# EasyEDA Pro project departure_board_controller.epro

# Schematic neo_pixel_carrier

## Sheets
1 Components: Board Name: neo_pixel_carrier; Create Date: 2024-08-07; Page Name: Components; Project Name: neo_pixel_carrier; Schematic Name: neo_pixel_carrier; Update Date: 2024-10-22; Company: EasyEDA.com; Drawn: EasyEDA; Page Size: A4; Part Number: JLCPCB-002; Reviewed: EasyEDA; Version: V0.1
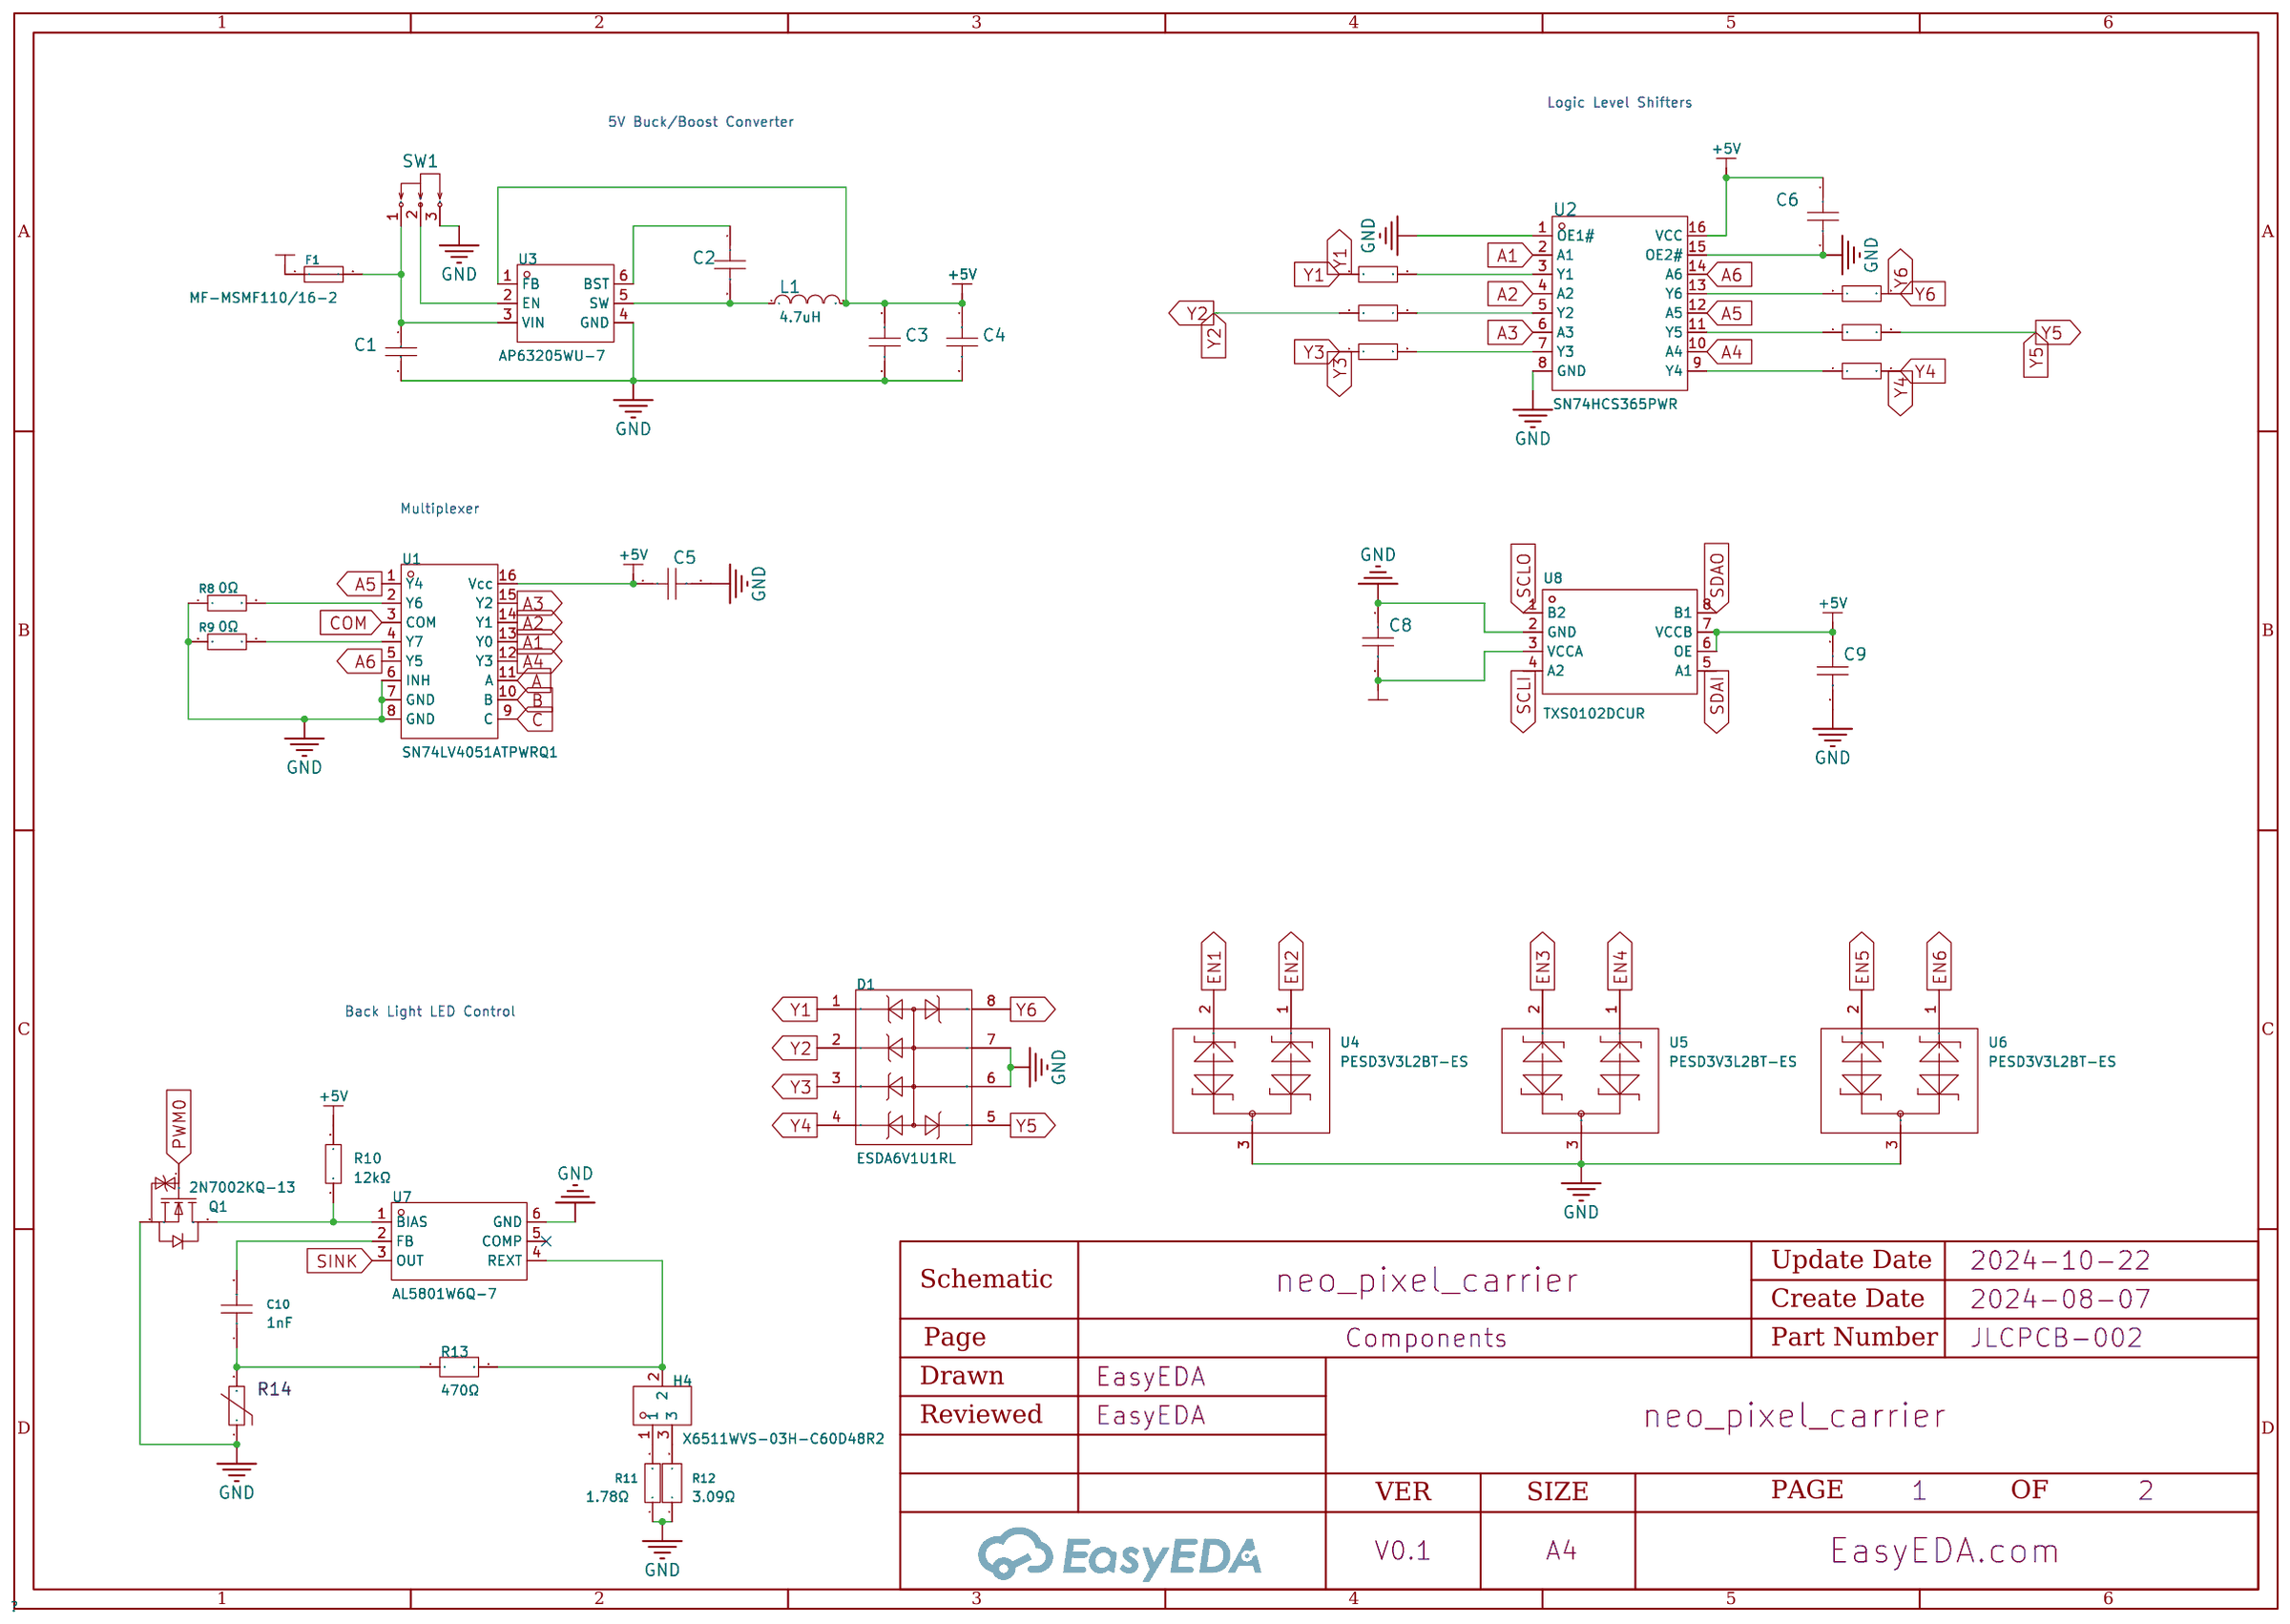
[diagram p0: Components]
2 Connectors: Page Name: Connectors; Update Date: 2024-10-03
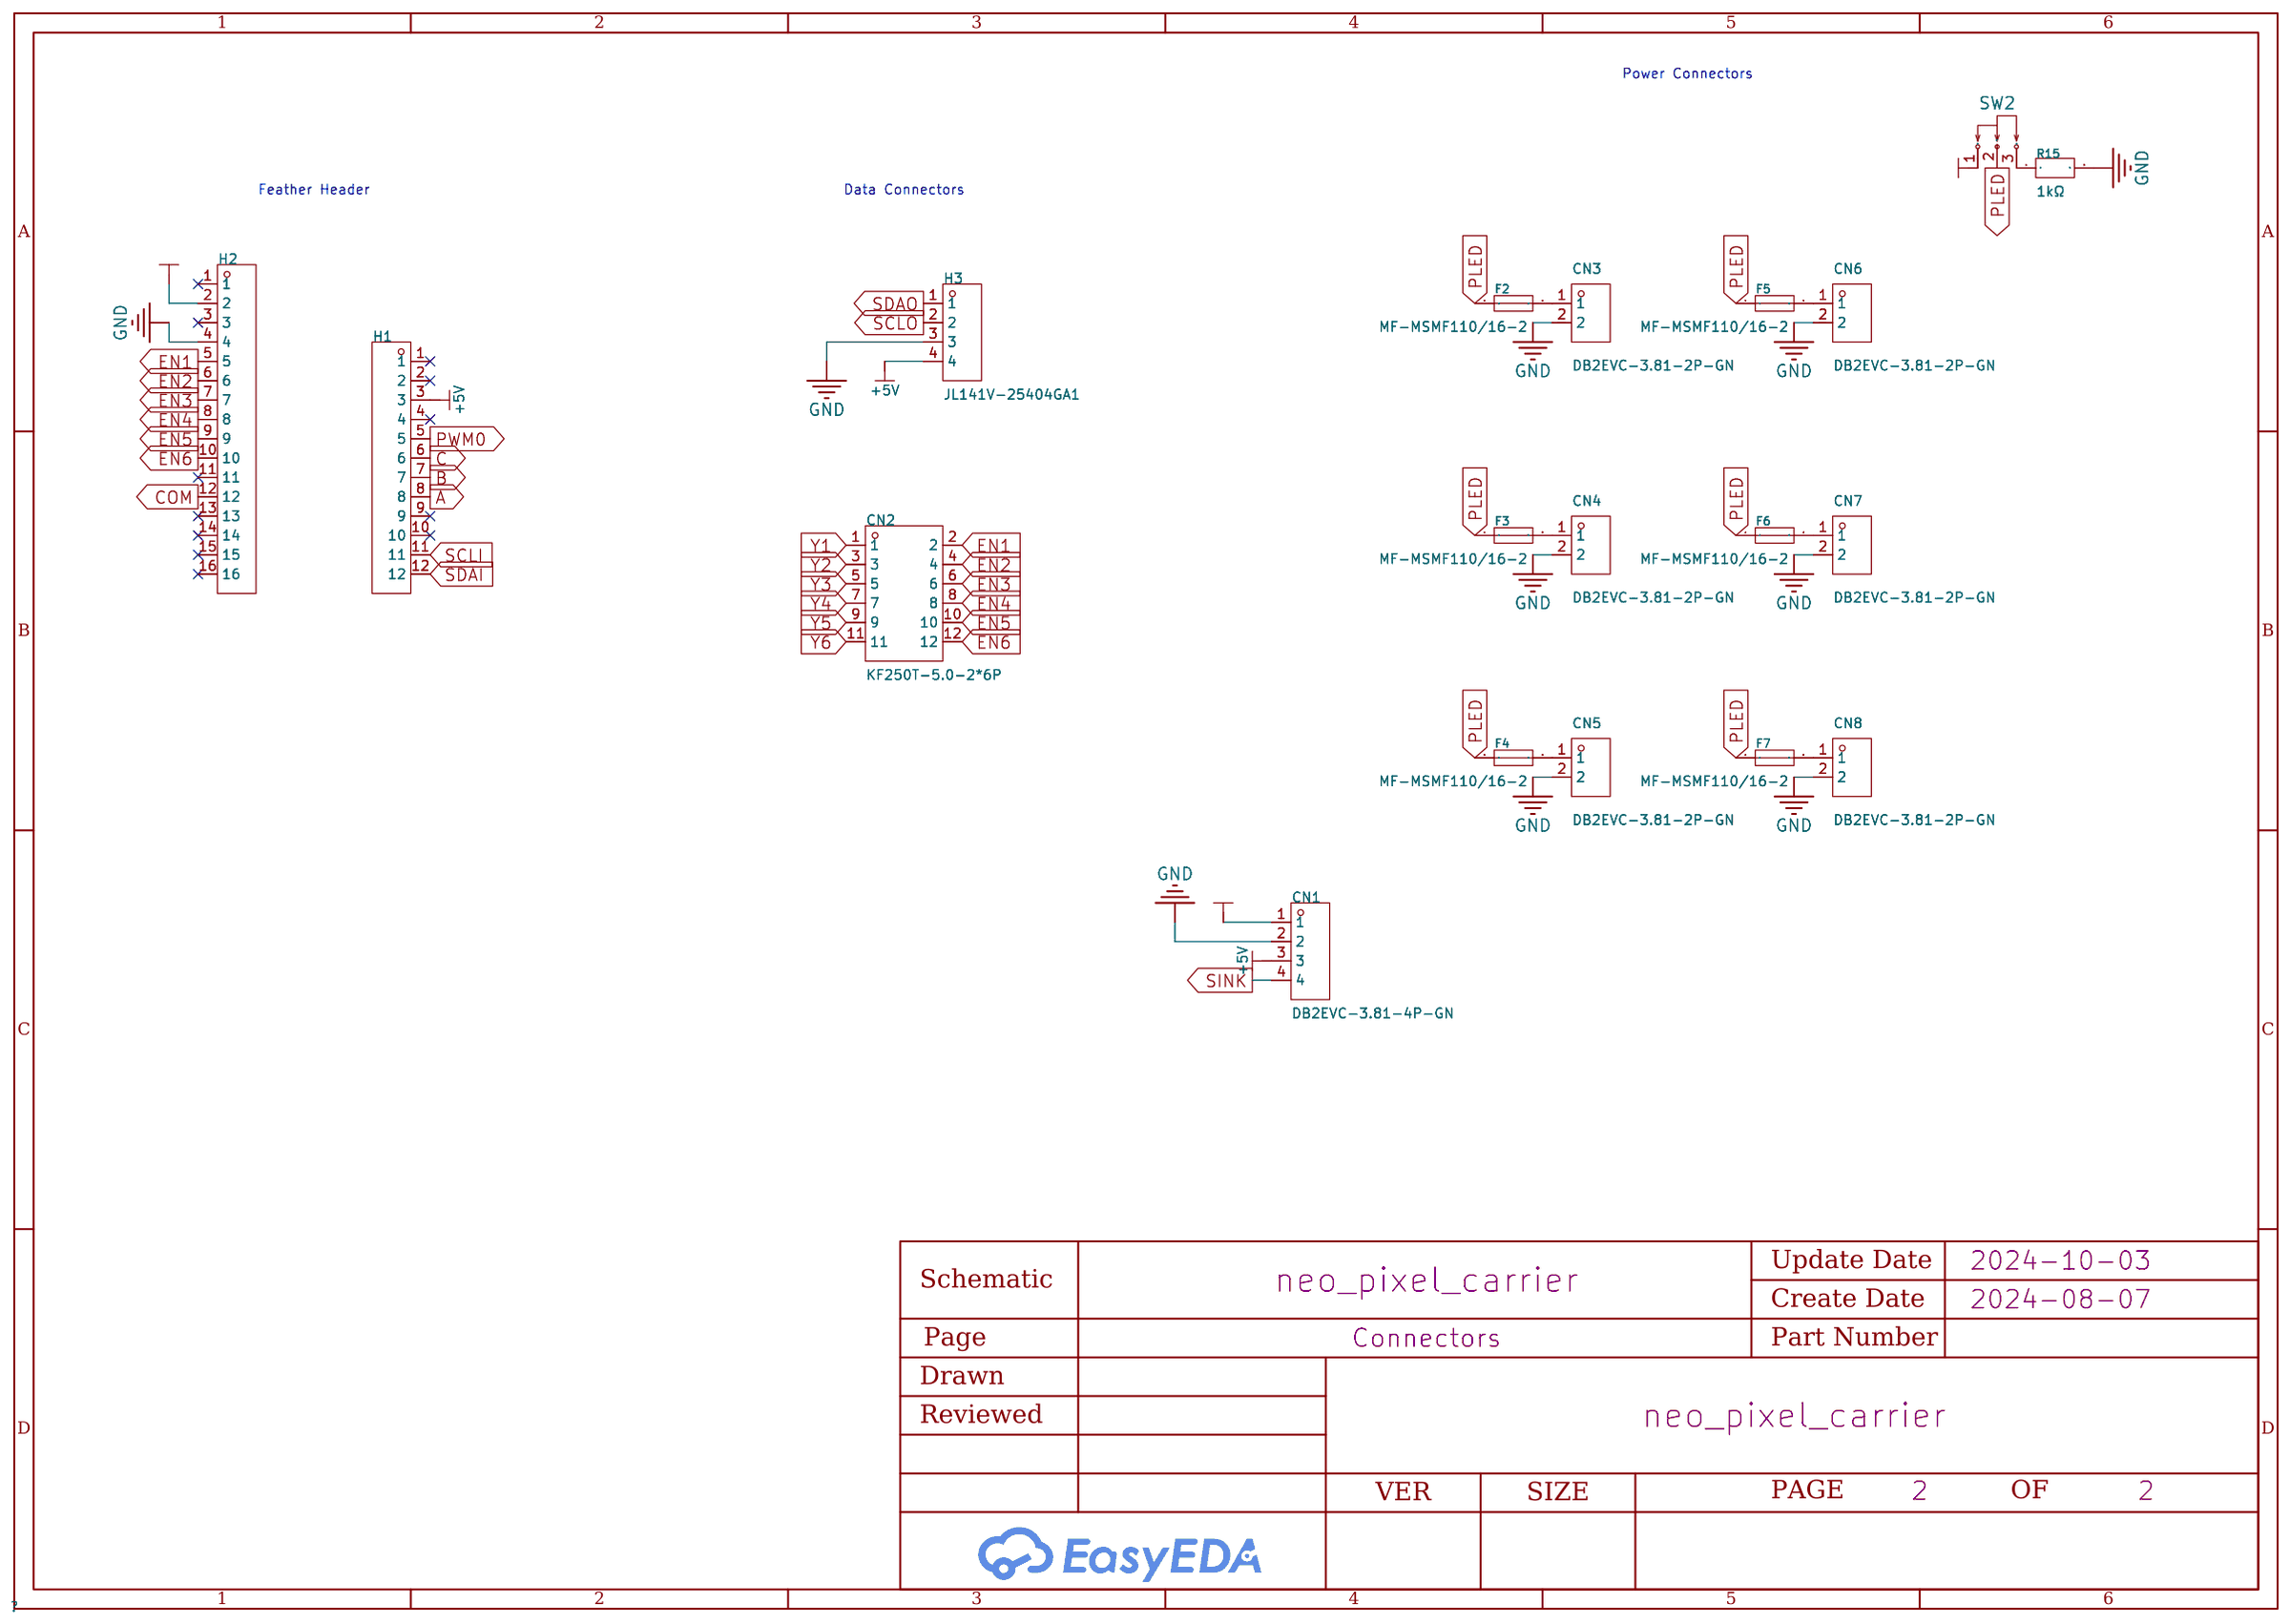
[diagram p1: Connectors]

## Parts
sheet Components
C1  10uF  [C1210]
C2  100nF  [C1206]
C3  22uF  [C1210]
C4  22uF  [C1210]
C5  100nF  [C1206]
C6  100nF  [C1206]
C8  100nF  [C1206]
C9  100nF  [C1206]
C10  1nF  [C0402]
D1  ESDA6V1U1RL  [SO-8_L4.9-W3.9-P1.27-LS5.9-BL]
F1  MF-MSMF110/16-2  [F1812]
H4  X6511WVS-03H-C60D48R2  [HDR-SMD_3P-P2.54_XKB_X6511WVS-03H-C60D48R2]
L1  4.7uH  [IND-SMD_L7.0-W7.0_CDRR7D45T125NP]
Q1  2N7002KQ-13  [SOT-23-3_L2.9-W1.3-P1.90-LS2.4-BR]
R1  100Ω  [R0805]
R2  100Ω  [R0805]
R3  100Ω  [R0805]
R4  100Ω  [R0805]
R5  100Ω  [R0805]
R6  100Ω  [R0805]
R8  0Ω  [R0805]
R9  0Ω  [R0805]
R10  12kΩ  [R0805]
R11  1.78Ω  [R0805]
R12  3.09Ω  [R0805]
R13  470Ω  [R0402]
R14  10k  [R0805]
SW1  SS12D10G4 071  [SW-TH_SHOU-HAN_SS12D10G4]
U1  SN74LV4051ATPWRQ1  [TSSOP-16_L5.0-W4.4-P0.65-LS6.4-BL]
U2  SN74HCS365PWR  [TSSOP-16_L5.0-W4.4-P0.65-LS6.4-BL]
U3  AP63205WU-7  [TSOT-23-6_L2.9-W1.6-P0.95-LS2.8-BL]
U4  PESD3V3L2BT-ES  [SOT-23-3_L2.9-W1.3-P0.95-LS2.4-BR]
U5  PESD3V3L2BT-ES  [SOT-23-3_L2.9-W1.3-P0.95-LS2.4-BR]
U6  PESD3V3L2BT-ES  [SOT-23-3_L2.9-W1.3-P0.95-LS2.4-BR]
U7  AL5801W6Q-7  [SOT-26-6_L3.0-W1.6-P0.95-LS2.8-BL]
U8  TXS0102DCUR  [VSON8_L2.0-W2.3-P0.50-LS3.1-BL]
sheet Connectors
CN1  DB2EVC-3.81-4P-GN  [CONN-TH_4P-P3.81_DB2EVC-3.81-4P]
CN2  KF250T-5.0-2*6P  [CONN-TH_KF250T-5.0-2X6P]
CN3  DB2EVC-3.81-2P-GN  [CONN-TH_2P-P3.81_DB2EVC-3.81-2P-BK]
CN4  DB2EVC-3.81-2P-GN  [CONN-TH_2P-P3.81_DB2EVC-3.81-2P-BK]
CN5  DB2EVC-3.81-2P-GN  [CONN-TH_2P-P3.81_DB2EVC-3.81-2P-BK]
CN6  DB2EVC-3.81-2P-GN  [CONN-TH_2P-P3.81_DB2EVC-3.81-2P-BK]
CN7  DB2EVC-3.81-2P-GN  [CONN-TH_2P-P3.81_DB2EVC-3.81-2P-BK]
CN8  DB2EVC-3.81-2P-GN  [CONN-TH_2P-P3.81_DB2EVC-3.81-2P-BK]
F2  MF-MSMF110/16-2  [F1812]
F3  MF-MSMF110/16-2  [F1812]
F4  MF-MSMF110/16-2  [F1812]
F5  MF-MSMF110/16-2  [F1812]
F6  MF-MSMF110/16-2  [F1812]
F7  MF-MSMF110/16-2  [F1812]
H1  A2541HWV-12P  [HDR-TH_12P-P2.54-V-F]
H2  ZX-PM2.54-1-16PY  [HDR-TH_16P-P2.54-V-F-A]
H3  JL141V-25404GA1  [CONN-TH_4P-P2.54_JILN_JL141V-25404GA1]
R15  1kΩ  [R0805]
SW2  SS12D10G4 071  [SW-TH_SHOU-HAN_SS12D10G4]

## Library data of the parts
C1 = CL32B106KAJNNNE: Capacitance: Tolerance:±10% Tolerance:±10% Voltage Rated: Temperature Coefficient:; LCSC Part Name: 10uF ±10% 25V; Supplier Part: C39232; Manufacturer: SAMSUNG(三星); Supplier Footprint: 1210; JLCPCB Part Class: Extended Part; Datasheet: https://atta.szlcsc.com/upload/public/pdf/source/20160218/1457707763339.pdf; Supplier: LCSC; Tolerance: ±10%; Check: false
C2 C5 C6 C8 C9 = 1206N104J500CT: Capacitance: Tolerance:±5% Tolerance:±5% Voltage Rated: Temperature Coefficient:; LCSC Part Name: 100nF ±5% 50V; Supplier Part: C170182; Manufacturer: Walsin(华新科); Supplier Footprint: 1206; JLCPCB Part Class: Extended Part; Datasheet: https://atta.szlcsc.com/upload/public/pdf/source/20190524/C388053_0CD3F469255EF43E616A57DAC128F58D.pdf; Supplier: LCSC; Tolerance: ±5%; Check: false
C3 C4 = CL32B226KAJNNNE: Capacitance: Tolerance:±10% Tolerance:±10% Voltage Rated: Temperature Coefficient:; LCSC Part Name: 22uF ±10% 25V; Supplier Part: C309062; Manufacturer: SAMSUNG(三星); Supplier Footprint: 1210; JLCPCB Part Class: Extended Part; Datasheet: https://atta.szlcsc.com/upload/public/pdf/source/20160218/1457707763339.pdf; Supplier: LCSC; Tolerance: ±10%; Check: false
C10 = GRM1555C1H102JA01D: Capacitance: Tolerance:±5% Tolerance:±5% Voltage Rated: Temperature Coefficient:; LCSC Part Name: 1nF ±5% 50V; Supplier Part: C76947; Manufacturer: muRata(村田); Supplier Footprint: 0402; JLCPCB Part Class: Extended Part; Datasheet: https://atta.szlcsc.com/upload/public/pdf/source/20180307/C76947_15204091165631407735.pdf; Supplier: LCSC; Tolerance: ±5%
D1 = ESDA6V1U1RL: polarity:Unidirectional Reverse Stand-Off Voltage (Vrwm):7.2V Maximum Clamping Voltage:6.1V Peak Pulse Power Dissipation (Ppp)@10/1000us:200W Breakdown Voltage:6.1V Number of Lines:Hex Type:ESD; LCSC Part Name: 单向ESD; Supplier Part: C118278; Manufacturer: ST(意法半导体); Supplier Footprint: SO-8; JLCPCB Part Class: Extended Part; Datasheet: https://atta.szlcsc.com/upload/public/pdf/source/20170713/C118278_1499918872050816706.pdf; Supplier: LCSC; polarity: Unidirectional; Reverse Stand-Off Voltage (Vrwm): 7.2V; Maximum Clamping Voltage: 6.1V; Peak Pulse Power Dissipation (Ppp)@10/1000us: 200W; Breakdown Voltage: 6.1V; Number of Lines: Hex; Type: ESD
F1-F7 = MF-MSMF110/16-2: Operating Voltage (Max):16V Current Rating (Max):100A Hold Current:1.1A Trip Current:2.2A Resistance - Initial (Ri) (Min):40mΩ Resistance - Post Trip (R1) (Max):210mΩ Maximum Time to Trip:300ms Operating Temperature:-40℃~+85℃ Operating Temperature:-40℃~+8; LCSC Part Name: 16V 1.1A 1812自恢复; Supplier Part: C210834; Manufacturer: BOURNS; Supplier Footprint: 1812; JLCPCB Part Class: Extended Part; Datasheet: https://atta.szlcsc.com/upload/public/pdf/source/20180613/C78695_965DA328FE7D692B5E486740BAAD1B3D.pdf; Supplier: LCSC; Operating Voltage (Max): 16V; Current Rating (Max): 100A; Hold Current: 1.1A; Trip Current: 2.2A; Resistance - Initial (Ri) (Min): 40mΩ; Resistance - Post Trip (R1) (Max): 210mΩ; Maximum Time to Trip: 300ms; Operating Temperature: -40℃~+85℃
H4 = X6511WVS-03H-C60D48R2: Pin Structure:1x3P Pitch:2.54mm Row Spacing:2.54mm Circluar Pins/Square Pins:Square Pins Mounting Type:- Number of Rows:Plugin Number of Pins:3P Current Rating (Max):3A Voltage Rating (Max):250V Length of Mating Pin:- Insulation Height:2.5mm Length of End; LCSC Part Name: 1x3P 间距:2.54mm 方针; Supplier Part: C2883760; Manufacturer: XKB Connection(中国星坤); Supplier Footprint: SMD,P=2.54mm; JLCPCB Part Class: Extended Part; Datasheet: https://atta.szlcsc.com/upload/public/pdf/source/20200909/C780060_F941EB1B69F43B5D6329EAF74E2E27BB.pdf; Supplier: LCSC; Pin Structure: 1x3P; Pitch: 2.54mm; Row Spacing: 2.54mm; Circluar Pins/Square Pins: Square Pins; Number of Rows: Plugin; Number of Pins: 3P; Current Rating (Max): 3A; Voltage Rating (Max): 250V; Insulation Height: 2.5mm; Contact Plating: Gold; Operating Temperature Range: -40℃~+105℃; Soldering Temperature(Max): 260℃; Color: Black
L1 = CDRR7D45T125NP-4R7MC: Inductance: Tolerance:±20% Tolerance:±20% Rated Current: Saturation Current (Isat):2.8A DC Resistance (DCR): Ratings:AEC-Q200; LCSC Part Name: 4.7uH ±20% 2.8A; Supplier Part: C171616; Manufacturer: Sumida(胜美达); Supplier Footprint: SMD,7x7mm; JLCPCB Part Class: Extended Part; Datasheet: https://atta.szlcsc.com/upload/public/pdf/source/20180612/C171616_538626DF09ADBAEB9516F00803148EA8.pdf; Supplier: LCSC; Tolerance: ±20%; Saturation Current (Isat): 2.8A; DC Resistance (DCR): 34.5mΩ; Ratings: AEC-Q200; Check: false
Q1 = 2N7002KQ-13: Type:1个NChannel Drain Source Voltage (Vdss): Continuous Drain Current (Id): Power Dissipation (Pd): Drain Source On Resistance (RDS(on)@Vgs,Id): Gate Threshold Voltage (Vgs(th)@Id):2.5V@1mA Total Gate Charge (Qg@Vgs):300pC@4.5V Input Capacitance (Ciss@Vds; LCSC Part Name: 1个N沟道 耐压:60V 电流:380mA; Supplier Part: C526325; Manufacturer: DIODES(美台); Supplier Footprint: SOT-23; JLCPCB Part Class: Extended Part; Datasheet: https://atta.szlcsc.com/upload/public/pdf/source/20200515/C526224_1AEA0AEAA9B62FCB654F783E23FA730A.pdf; Supplier: LCSC; Type: 1个NChannel; Gate Threshold Voltage (Vgs(th)@Id): 2.5V@1mA; Total Gate Charge (Qg@Vgs): 300pC@4.5V; Input Capacitance (Ciss@Vds): 50pF@25V; Operating Temperature: -55℃~+150℃@(Tj)
R1-R6 = ERA6AEB101V: Type:Thin Film Resistor Resistance: Tolerance:±0.1% Tolerance:±0.1% Power(Watts): Overload Voltage (Max): Temperature Coefficient:±25ppm/℃ Temperature Coefficient:±25ppm/℃ Operating Temperature Range:-55℃~+155℃ Operating Temperature Range:-55℃~+155℃; LCSC Part Name: 100Ω ±0.1% 125mW 薄膜电阻; Supplier Part: C445646; Manufacturer: PANASONIC(松下); Supplier Footprint: 0805; JLCPCB Part Class: Extended Part; Datasheet: https://atta.szlcsc.com/upload/public/pdf/source/20220726/97950D08E3EA8CC4F1F63A0C564F66E4.pdf; Supplier: LCSC; Type: Thin Film Resistor; Tolerance: ±0.1%; Temperature Coefficient: ±25ppm/℃; Operating Temperature Range: -55℃~+155℃
R8 R9 = RTT050000FTP: Type:Thick Film Resistors Resistance: Tolerance:±1% Tolerance:±1% Power(Watts): Overload Voltage (Max): Operating Temperature Range:-55℃~+155℃ Operating Temperature Range:-55℃~+155℃; LCSC Part Name: 厚膜电阻 0Ω ±1% 125mW; Supplier Part: C103900; Manufacturer: RALEC(旺诠); Supplier Footprint: 0805; JLCPCB Part Class: Extended Part; Datasheet: https://atta.szlcsc.com/upload/public/pdf/source/20191219/C158410_884373A5B7E1BC76BF57BC45A946C093.pdf; Supplier: LCSC; Type: Thick Film Resistors; Tolerance: ±1%; Operating Temperature Range: -55℃~+155℃
R10 = PTFR0805B12K0N9: Type:Thin Film Resistor Resistance: Tolerance:±0.1% Tolerance:±0.1% Power(Watts): Overload Voltage (Max): Temperature Coefficient:±10ppm/℃ Temperature Coefficient:±10ppm/℃ Operating Temperature Range:-55℃~+125℃ Operating Temperature Range:-55℃~+125℃; LCSC Part Name: 薄膜电阻 12kΩ ±0.1% 130mW; Supplier Part: C351614; Manufacturer: RESI(开步睿思); Supplier Footprint: 0805; JLCPCB Part Class: Extended Part; Datasheet: https://atta.szlcsc.com/upload/public/pdf/source/20240506/11BDC7478D84177AC2A5326A65B6EB29.pdf; Supplier: LCSC; Type: Thin Film Resistor; Tolerance: ±0.1%; Temperature Coefficient: ±10ppm/℃; Operating Temperature Range: -55℃~+125℃
R11 = TR0805D1R78P0525: Type:Thin Film Resistor Resistance: Tolerance:±0.5% Tolerance:±0.5% Power(Watts): Overload Voltage (Max): Temperature Coefficient:±25ppm/℃ Temperature Coefficient:±25ppm/℃ Operating Temperature Range:-55℃~+155℃ Operating Temperature Range:-55℃~+155℃; LCSC Part Name: 薄膜电阻 1.78Ω ±0.5% 125mW; Supplier Part: C149982; Manufacturer: EVER OHMS(天二科技); Supplier Footprint: 0805; JLCPCB Part Class: Extended Part; Datasheet: https://atta.szlcsc.com/upload/public/pdf/source/20190918/C429510_4513AD098FCD1E1EB01EBF3597E9489F.pdf; Supplier: LCSC; Type: Thin Film Resistor; Tolerance: ±0.5%; Temperature Coefficient: ±25ppm/℃; Operating Temperature Range: -55℃~+155℃
R12 = WR08W3R09FTL: Type:Thick Film Resistors Resistance: Tolerance:±1% Tolerance:±1% Power(Watts): Overload Voltage (Max): Temperature Coefficient:-200ppm/℃~+400ppm/℃ Temperature Coefficient:-200ppm/℃~+400ppm/℃ Operating Temperature Range:-55℃~+155℃ Operating Temperature Ra; LCSC Part Name: 厚膜电阻 3.09Ω ±1% 125mW; Supplier Part: C367858; Manufacturer: Walsin(华新科); Supplier Footprint: 0805; JLCPCB Part Class: Extended Part; Datasheet: https://atta.szlcsc.com/upload/public/pdf/source/20191217/C470037_D99261402F77DA8B1D609223749D445A.pdf; Supplier: LCSC; Type: Thick Film Resistors; Tolerance: ±1%; Temperature Coefficient: -200ppm/℃~+400ppm/℃; Operating Temperature Range: -55℃~+155℃
R13 = ERA2AEB471X: Type:Thin Film Resistor Resistance: Tolerance:±0.1% Tolerance:±0.1% Power(Watts): Overload Voltage (Max): Temperature Coefficient:±25ppm/℃ Temperature Coefficient:±25ppm/℃ Operating Temperature Range:-55℃~+155℃ Operating Temperature Range:-55℃~+155℃; LCSC Part Name: 薄膜电阻 470Ω ±0.1% 63mW; Supplier Part: C445590; Manufacturer: PANASONIC(松下); Supplier Footprint: 0402; JLCPCB Part Class: Extended Part; Supplier: LCSC; Type: Thin Film Resistor; Tolerance: ±0.1%; Temperature Coefficient: ±25ppm/℃; Operating Temperature Range: -55℃~+155℃
R14 = KNTC0805/10KJ3450: Resistance @ 25℃: B Constant (25℃/50℃): Resistance Tolerance: B Constant (25℃/75℃):- B Constant (25℃/85℃):3500K B Constant (25℃/100℃):- Power: B Constant Tolerance: Steady State Current (Max):440uA Operating Temperature:-40℃~+125℃ Operating Temperature:-4; LCSC Part Name: 10kΩ 电阻精度:±5% 3450K; Supplier Part: C2892551; Manufacturer: KUU; Supplier Footprint: 0805; JLCPCB Part Class: Extended Part; Datasheet: https://atta.szlcsc.com/upload/public/pdf/source/20210908/8AD232001E0885096CB42DF4AB8319A2.pdf; Supplier: LCSC; B Constant (25℃/85℃): 3500K; Steady State Current (Max): 440uA; Operating Temperature: -40℃~+125℃; Type: Thin Film Resistor; Tolerance: ±0.5%; Temperature Coefficient: ±25ppm/℃; Operating Temperature Range: -55℃~+155℃
SW1 SW2 = SS12D10G4 071: Circuit:SPDT Actuator Style:- Pin Style:PCPin Switch Length:12.7mm Switch Width:6.7mm Switch Height:6.4mm Mounting Style:Straight Actuator Color:- Current Rating (DC):2A Voltage Rating (DC):125V Current Rating (AC):- Voltage Rating (AC):- Mechanical Life:; Supplier Part: C2887259; Manufacturer: SHOU HAN(首韩); Supplier Footprint: 插件; JLCPCB Part Class: Extended Part; Datasheet: https://atta.szlcsc.com/upload/public/pdf/source/20210820/80D1704BBF3FCEE0435FCAA54C61E0A3.pdf; Supplier: LCSC; Circuit: SPDT; Pin Style: PCPin; Switch Length: 12.7mm; Switch Width: 6.7mm; Switch Height: 6.4mm; Mounting Style: Straight; Current Rating (DC): 2A; Voltage Rating (DC): 125V; Mechanical Life: 3千次; Operating Temperature: -16℃~+60℃
U1 = SN74LV4051ATPWRQ1: Number of Channels:1 Supply Voltage:2V~5.5V Supply Voltage:2V~5.5V Turn-on time:14ns On-State Resistance (Max):75Ω Turn-off time:14ns; Supplier Part: C882802; Manufacturer: TI(德州仪器); Supplier Footprint: TSSOP-16; JLCPCB Part Class: Extended Part; Datasheet: https://www.ti.com/cn/lit/gpn/sn74lv4051a-q1; Supplier: LCSC; Number of Channels: 1; Supply Voltage: 2V~5.5V; Turn-on time: 14ns; On-State Resistance (Max): 75Ω; Turn-off time: 14ns
U2 = SN74HCS365PWR: Input type:Schmitt Trigger output type:Tri-State Supply Voltage:2V~6V Supply Voltage:2V~6V Number of Elements:6 Number of Bits per Element:6 Sink Current:7.8mA Source Current:7.8mA Logic Family:74HCS Operating Temperature:-40℃~+125℃ Operating Temperature:; Supplier Part: C2868026; Manufacturer: TI(德州仪器); Supplier Footprint: TSSOP-16; JLCPCB Part Class: Extended Part; Datasheet: https://www.ti.com/cn/lit/gpn/sn74hcs365; Supplier: LCSC; Input type: Schmitt Trigger; output type: Tri-State; Supply Voltage: 2V~6V; Number of Elements: 6; Number of Bits per Element: 6; Sink Current: 7.8mA; Source Current: 7.8mA; Logic Family: 74HCS; Operating Temperature: -40℃~+125℃
U3 = AP63205WU-7: Function:Step-down type Synchronous Rectification:Yes Output Type:Fixed Number of Outputs:1 Topology:Step-down Input Voltage:3.8V~32V Input Voltage:3.8V~32V Output Voltage:5V Output Voltage:5V Output Current (Max):2A Switching Frequency:1.1MHz Operating T; LCSC Part Name: 降压型 输入3.8V~32V 输出5V 2A; Supplier Part: C2071056; Manufacturer: DIODES(美台); Supplier Footprint: TSOT-26-6; JLCPCB Part Class: Extended Part; Datasheet: https://atta.szlcsc.com/upload/public/pdf/source/20210622/C780769_099C67289BD3EC61AAFB52D8B07125B3.pdf; Supplier: LCSC; Function: Step-down type; Synchronous Rectification: Yes; Output Type: Fixed; Number of Outputs: 1; Topology: Step-down; Input Voltage: 3.8V~32V; Output Voltage: 5V; Output Current (Max): 2A; Switching Frequency: 1.1MHz; Operating Temperature: -40℃~+85℃@(TA); Check: false
U4-U6 = PESD3V3L2BT-ES: polarity:Bidirectional Reverse Stand-Off Voltage (Vrwm):3.3V Maximum Clamping Voltage:12V Peak Pulse Current (Ipp)@10/1000us:30A Peak Pulse Power Dissipation (Ppp)@10/1000us:500W Breakdown Voltage:3.6V Reverse Leakage Current (Ir):1uA Number of Lines:Dual; LCSC Part Name: 反向关断电压（典型值）:3.3V(Max) 击穿电压（最小值）:4.5V 箝位电压:8.5V 峰值脉冲电流:24A (8/20us) 极性:Bidirectional; Supplier Part: C5180242; Manufacturer: ElecSuper(静芯微); Supplier Footprint: SOT-23; JLCPCB Part Class: Extended Part; Datasheet: https://atta.szlcsc.com/upload/public/pdf/source/20220919/D2D0B671B253D4BC486081DE00F3ACE0.pdf; Supplier: LCSC; polarity: Bidirectional; Reverse Stand-Off Voltage (Vrwm): 3.3V; Maximum Clamping Voltage: 12V; Peak Pulse Current (Ipp)@10/1000us: 30A; Peak Pulse Power Dissipation (Ppp)@10/1000us: 500W; Breakdown Voltage: 3.6V; Reverse Leakage Current (Ir): 1uA; Number of Lines: Dual channel; Type: ESD
U7 = AL5801W6Q-7: Type:- Input Voltage:3.5V~20V Input Voltage:3.5V~20V Channels:1 Output Voltage:1.1V~100V Output Voltage:1.1V~100V Output Current:350mA Dimming:PWM Operating temperature:-40℃~+125℃ Operating temperature:-40℃~+125℃; Supplier Part: C2678629; Manufacturer: DIODES(美台); Supplier Footprint: SOT-26; JLCPCB Part Class: Extended Part; Datasheet: https://atta.szlcsc.com/upload/public/pdf/source/20180504/C211395_340AFB483A703338E0C493C9847AA948.pdf; Supplier: LCSC; Input Voltage: 3.5V~20V; Channels: 1; Output Voltage: 1.1V~100V; Output Current: 350mA; Dimming: PWM; Operating temperature: -40℃~+125℃
U8 = TXS0102DCUR: Channel Type:Bi-Directional Input Signal:- Output Signal:- Data Rate:24Mbps Supply Voltage (VCCA):1.65V~3.6V Supply Voltage (VCCA):1.65V~3.6V Supply Voltage (VCCB):2.3V~5.5V Supply Voltage (VCCB):2.3V~5.5V Number of Circuits:1 Channels per Circuit:2 Outpu; LCSC Part Name: 24Mbps 2位双向电平转换器; Supplier Part: C53434; Manufacturer: TI(德州仪器); Supplier Footprint: VSSOP-8; JLCPCB Part Class: Extended Part; Datasheet: https://www.ti.com/cn/lit/gpn/txs0102; Supplier: LCSC; Channel Type: Bi-Directional; Data Rate: 24Mbps; Supply Voltage (VCCA): 1.65V~3.6V; Supply Voltage (VCCB): 2.3V~5.5V; Number of Circuits: 1; Channels per Circuit: 2; Output Type: Open Drain；Push-pull; Operating Temperature: -40℃~+85℃; Features: 自动方向检测
CN1 = DB2EVC-3.81-4P-GN: Connector Type:板端/Receptacle-Close Structure:1x4P Pitch:3.81mm Color:Green Mounting Style:直针 Number of Pins:4P Number of Rows:1 Number of PINs Per Row:4 Current Rating (Max):10A Voltage Rating (Max):250V Operating Temperature Range:-40℃~+105℃ Operating Te; LCSC Part Name: 3.81mm 1x4P 排数:1 每排P数:4; Supplier Part: C395697; Manufacturer: DORABO(地博电气); Supplier Footprint: 插件,P=3.81mm; JLCPCB Part Class: Extended Part; Datasheet: https://atta.szlcsc.com/upload/public/pdf/source/20230106/E295F87ABDAA44E449E4D4A582259339.pdf; Supplier: LCSC; Connector Type: 板端/Receptacle-Close; Structure: 1x4P; Pitch: 3.81mm; Color: Green; Mounting Style: 直针; Number of Pins: 4P; Number of Rows: 1; Number of PINs Per Row: 4; Current Rating (Max): 10A; Voltage Rating (Max): 250V; Operating Temperature Range: -40℃~+105℃
CN2 = KF250T-5.0-2*6P: Structure:2x6P Pitch:5mm Color:Gray Mounting Style:- Number of Pins:12P Number of PINs Per Row:6 Current Rating (Max):12A Voltage Rating (Max):450V Wire Gauge - AWG:16~22 Wire Gauge - mm2:1.5 Operating Temperature Range:-40℃~+105℃ Operating Temperature Ra; LCSC Part Name: 2x6P 5mm 每排P数:6 排数:2; Supplier Part: C976540; Manufacturer: KEFA(科发); Supplier Footprint: 插件,P=5mm; JLCPCB Part Class: Extended Part; Datasheet: https://atta.szlcsc.com/upload/public/pdf/source/20230317/1F1300AA9B1B13CB03AD141F84F79F6E.pdf; Supplier: LCSC; Structure: 2x6P; Pitch: 5mm; Color: Gray; Number of Pins: 12P; Number of PINs Per Row: 6; Current Rating (Max): 12A; Voltage Rating (Max): 450V; Wire Gauge - AWG: 16~22; Wire Gauge - mm2: 1.5; Operating Temperature Range: -40℃~+105℃; Number of Rows: 2
CN3-CN8 = DB2EVC-3.81-2P-GN: Connector Type:板端/Receptacle-Close Structure:1x2P Pitch:3.81mm Color:Green Mounting Style:直针 Number of Pins:2P Number of Rows:1 Number of PINs Per Row:2 Current Rating (Max):10A Voltage Rating (Max):250V Operating Temperature Range:-40℃~+105℃ Operating Te; LCSC Part Name: 3.81mm 1x2P 排数:1 每排P数:2; Supplier Part: C395686; Manufacturer: DORABO(地博电气); Supplier Footprint: 插件,P=3.81mm; JLCPCB Part Class: Extended Part; Datasheet: https://atta.szlcsc.com/upload/public/pdf/source/20230106/E295F87ABDAA44E449E4D4A582259339.pdf; Supplier: LCSC; Connector Type: 板端/Receptacle-Close; Structure: 1x2P; Pitch: 3.81mm; Color: Green; Mounting Style: 直针; Number of Pins: 2P; Number of Rows: 1; Number of PINs Per Row: 2; Current Rating (Max): 10A; Voltage Rating (Max): 250V; Operating Temperature Range: -40℃~+105℃
H1 = A2541HWV-12P_C5340512: Holes Structure:1x12P Pitch:2.54mm Row Spacing:- Circular Hole / Square Hole:方孔 Mounting Type:Straight Number of Rows:Plugin Number of Holes:12P Current Rating (Max):3A Voltage Rating (Max):250V Holes Direction:Top Insulation Height:8.5mm Contact Material; LCSC Part Name: 1x12P 间距:2.54mm 直插; Supplier Part: C5340512; Manufacturer: CJT(长江连接器); Supplier Footprint: 插件,P=2.54mm; JLCPCB Part Class: Extended Part; Datasheet: https://atta.szlcsc.com/upload/public/pdf/source/20190522/C339348_148DC62DFEE35B66DE27661541078F4A.pdf; Supplier: LCSC; Holes Structure: 1x12P; Pitch: 2.54mm; Circular Hole / Square Hole: 方孔; Mounting Type: Straight; Number of Rows: Plugin; Number of Holes: 12P; Current Rating (Max): 3A; Voltage Rating (Max): 250V; Holes Direction: Top; Insulation Height: 8.5mm; Contact Material: Brass; Contact Plating: Gold; Operating Temperature Range: -40℃~+105℃; PIN Length: 3.2mm
H2 = ZX-PM2.54-1-16PY: Holes Structure:1x16P Pitch:2.54mm Row Spacing:- Circular Hole / Square Hole:方孔 Mounting Type:Straight Number of Rows:Plugin Number of Holes:16P Current Rating (Max):3A Voltage Rating (Max):1kV Holes Direction:Top Insulation Height:8.5mm Contact Material:; LCSC Part Name: 间距:2.54mm 1x16P 直插; Supplier Part: C7499334; Manufacturer: Megastar(兆星); Supplier Footprint: 插件,P=2.54mm; JLCPCB Part Class: Extended Part; Datasheet: https://atta.szlcsc.com/upload/public/pdf/source/20231122/06C87E20B1C933D920A2198AD43CBCB1.pdf; Supplier: LCSC; Holes Structure: 1x16P; Pitch: 2.54mm; Circular Hole / Square Hole: 方孔; Mounting Type: Straight; Number of Rows: Plugin; Number of Holes: 16P; Current Rating (Max): 3A; Voltage Rating (Max): 1kV; Holes Direction: Top; Insulation Height: 8.5mm; Contact Material: bronze; Contact Plating: Gold; Operating Temperature Range: -40℃~+105℃; Soldering Temperature(Max): 260℃@5S
H3 = JL141V-25404GA1: Structure:1x4P Pitch:2.54mm Color:Green Mounting Style:Direct Insert Number of Pins:4P Number of PINs Per Row:4 Current Rating (Max):5A Voltage Rating (Max):150V Wire Gauge - AWG:20~26 Wire Gauge - mm2:- Operating Temperature Range:-40℃~+105℃ Operating Te; LCSC Part Name: 1x4P 2.54mm 每排P数:4 排数:1; Supplier Part: C2922621; Manufacturer: JILN(锦凌); Supplier Footprint: 插件,P=2.54mm; JLCPCB Part Class: Extended Part; Datasheet: https://atta.szlcsc.com/upload/public/pdf/source/20211227/2C567E0B0D2A1715225C62ED46B7B6C9.pdf; Supplier: LCSC; Structure: 1x4P; Pitch: 2.54mm; Color: Green; Mounting Style: Direct Insert; Number of Pins: 4P; Number of PINs Per Row: 4; Current Rating (Max): 5A; Voltage Rating (Max): 150V; Wire Gauge - AWG: 20~26; Operating Temperature Range: -40℃~+105℃; Number of Rows: 1
R15 = ERJ-HP6F1001V: Type:Thick Film Resistors Resistance:1kΩ Tolerance:±1% Tolerance:±1% Power(Watts): Temperature Coefficient:±100ppm/℃ Temperature Coefficient:±100ppm/℃ Operating Temperature Range:-55℃~+175℃ Operating Temperature Range:-55℃~+175℃; LCSC Part Name: 1kΩ ±1% 500mW 厚膜电阻; Supplier Part: C4264406; Manufacturer: PANASONIC(松下); Supplier Footprint: 0805; JLCPCB Part Class: Extended Part; Supplier: LCSC; Type: Thick Film Resistors; Tolerance: ±1%; Temperature Coefficient: ±100ppm/℃; Operating Temperature Range: -55℃~+175℃

## Nets
+3.3V: C8.2 H2.2 U8.3(VCCA)
+5V: C3.1 C4.1 C5.1 C6.1 C9.1 CN1.3 H1.3 H3.4 L1.2 R10.2 U1.16(Vcc) U2.16(VCC) U3.1(FB) U8.6(OE) U8.7(VCCB)
GND: C1.2 C3.2 C4.2 C5.2 C6.2 C8.1 C9.2 CN1.2 CN3.2 CN4.2 CN5.2 CN6.2 CN7.2 CN8.2 D1.6(GND) D1.7(GND) H2.4 H3.3 Q1.2(S) R8.1 R9.1 R11.1 R12.1 R14.1 R15.2 SW1.3 U1.6(INH) U1.7(GND) U1.8(GND) U2.1(OE1#) U2.8(GND) U2.15(OE2#) U3.4(GND) U4.3 U5.3 U6.3 U7.6(GND) U8.2(GND)
VCC: CN1.1 F1.1 SW2.1
A: H1.8 U1.11(A)
A1: U1.13(Y0) U2.2(A1)
A2: U1.14(Y1) U2.4(A2)
A3: U1.15(Y2) U2.6(A3)
A4: U1.12(Y3) U2.10(A4)
A5: U1.1(Y4) U2.12(A5)
A6: U1.5(Y5) U2.14(A6)
B: H1.7 U1.10(B)
C: H1.6 U1.9(C)
COM: H2.12 U1.3(COM)
EN1: CN2.2 H2.5 U4.2
EN2: CN2.4 H2.6 U4.1
EN3: CN2.6 H2.7 U5.2
EN4: CN2.8 H2.8 U5.1
EN5: CN2.10 H2.9 U6.2
EN6: CN2.12 H2.10 U6.1
PLED: F2.1 F3.1 F4.1 F5.1 F6.1 F7.1 SW2.2
PWM0: H1.5 Q1.1(G)
SCLI: H1.11 U8.4(A2)
SCLO: H3.2 U8.1(B2)
SDAI: H1.12 U8.5(A1)
SDAO: H3.1 U8.8(B1)
SINK: CN1.4 U7.3(OUT)
Y1: CN2.1 D1.1(I/O1) R1.1
Y2: CN2.3 D1.2(I/O2) R2.1
Y3: CN2.5 D1.3(I/O3) R3.1
Y4: CN2.7 D1.4(I/O4) R4.2
Y5: CN2.9 D1.5(I/O5) R5.2
Y6: CN2.11 D1.8(I/O6) R6.2
$1N1490: C1.1 F1.2 SW1.1 U3.3(VIN)
$1N1493: C2.1 U3.6(BST)
$1N1494: C2.2 L1.1 U3.5(SW)
$1N1619: SW1.2 U3.2(EN)
$1N2001: R1.2 U2.3(Y1)
$1N2005: R2.2 U2.5(Y2)
$1N2010: R3.2 U2.7(Y3)
$1N2012: R4.1 U2.9(Y4)
$1N2014: R5.1 U2.11(Y5)
$1N2016: R6.1 U2.13(Y6)
$1N3607: R8.2 U1.2(Y6)
$1N3609: R9.2 U1.4(Y7)
$1N7662: Q1.3(D) R10.1 U7.1(BIAS)
$1N7863: H4.1 R11.2
$1N7940: H4.3 R12.2
$1N13533: H4.2 R13.2 U7.4(REXT)
$2N3226: CN3.1 F2.2
$2N3269: CN4.1 F3.2
$2N3312: CN5.1 F4.2
$2N3355: CN6.1 F5.2
$2N3398: CN7.1 F6.2
$2N3441: CN8.1 F7.2
$2N9936: R15.1 SW2.3
Net-(C10-1): C10.1 R13.1 R14.2
Net-(C10-2): C10.2 U7.2(FB)

Not connected (* = marked no-connect by the designer): H1 1* 2* 4* 9* 10*; H2 1* 3* 11* 13* 14* 15* 16*; U7 5(COMP)*

## Notes on the sheets
sheet 1
- Logic Level Shifters
- 5V Buck/Boost Converter
- Multiplexer
- Back Light LED Control
sheet 2
- Power Connectors
- Feather Header
- Data Connectors

# Board PCB2
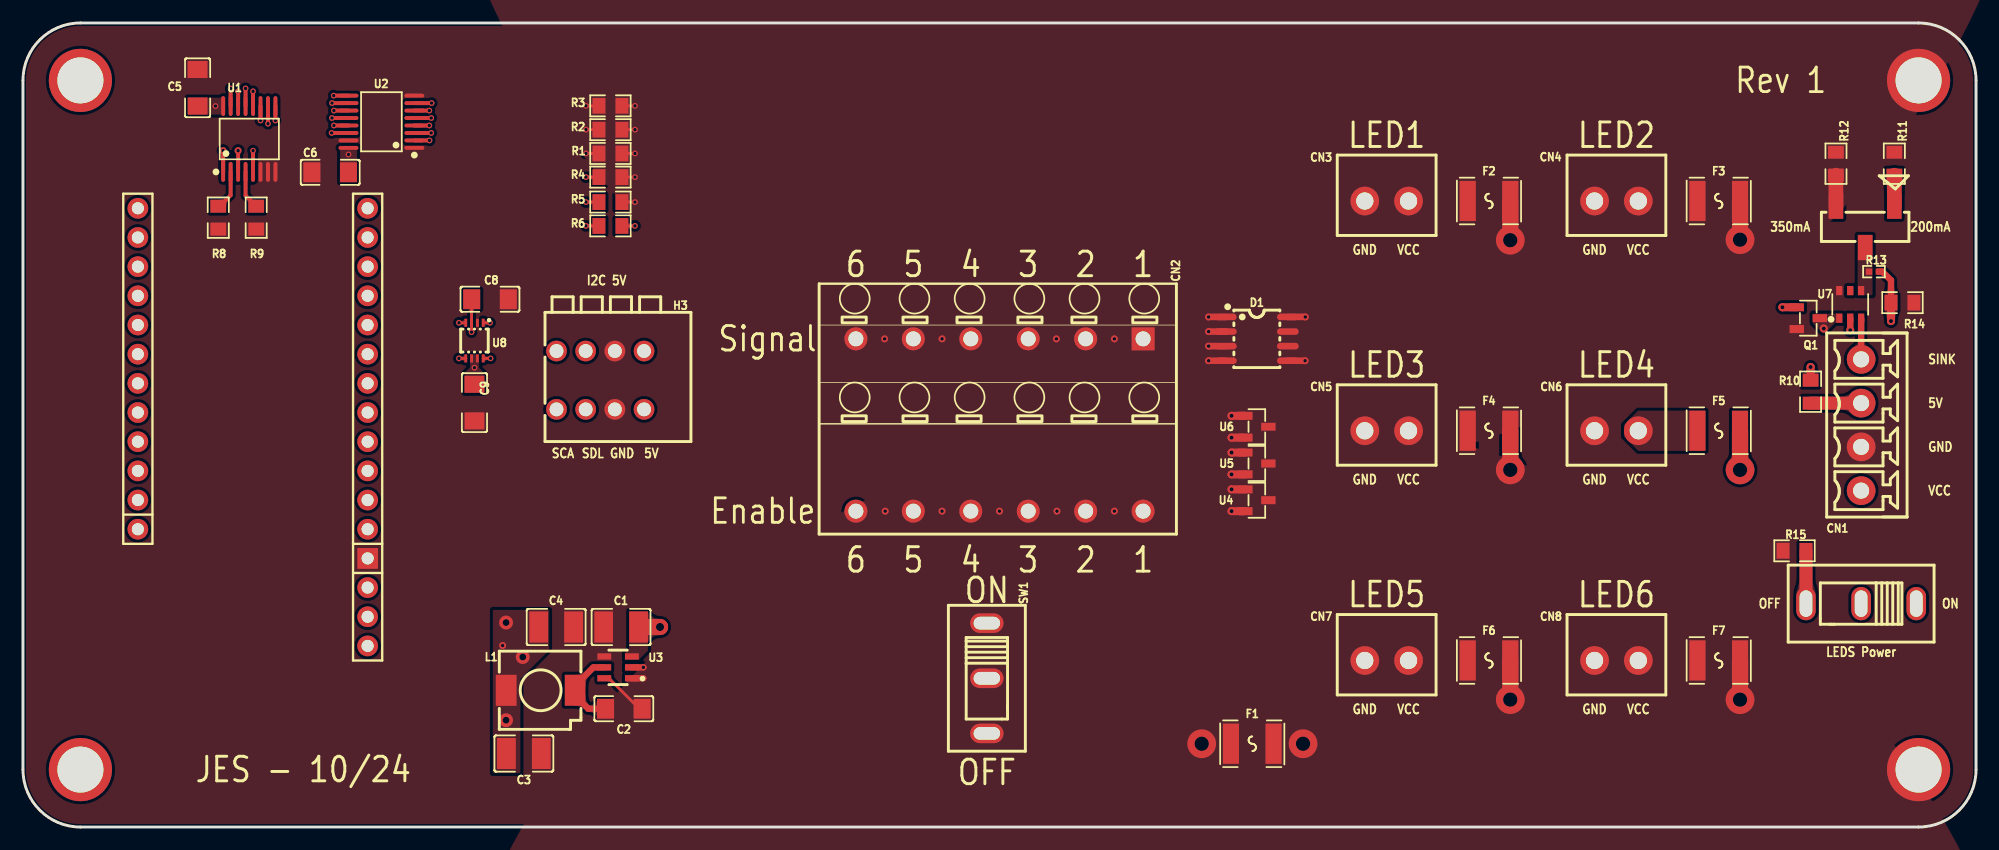
[diagram p2: board, top side]
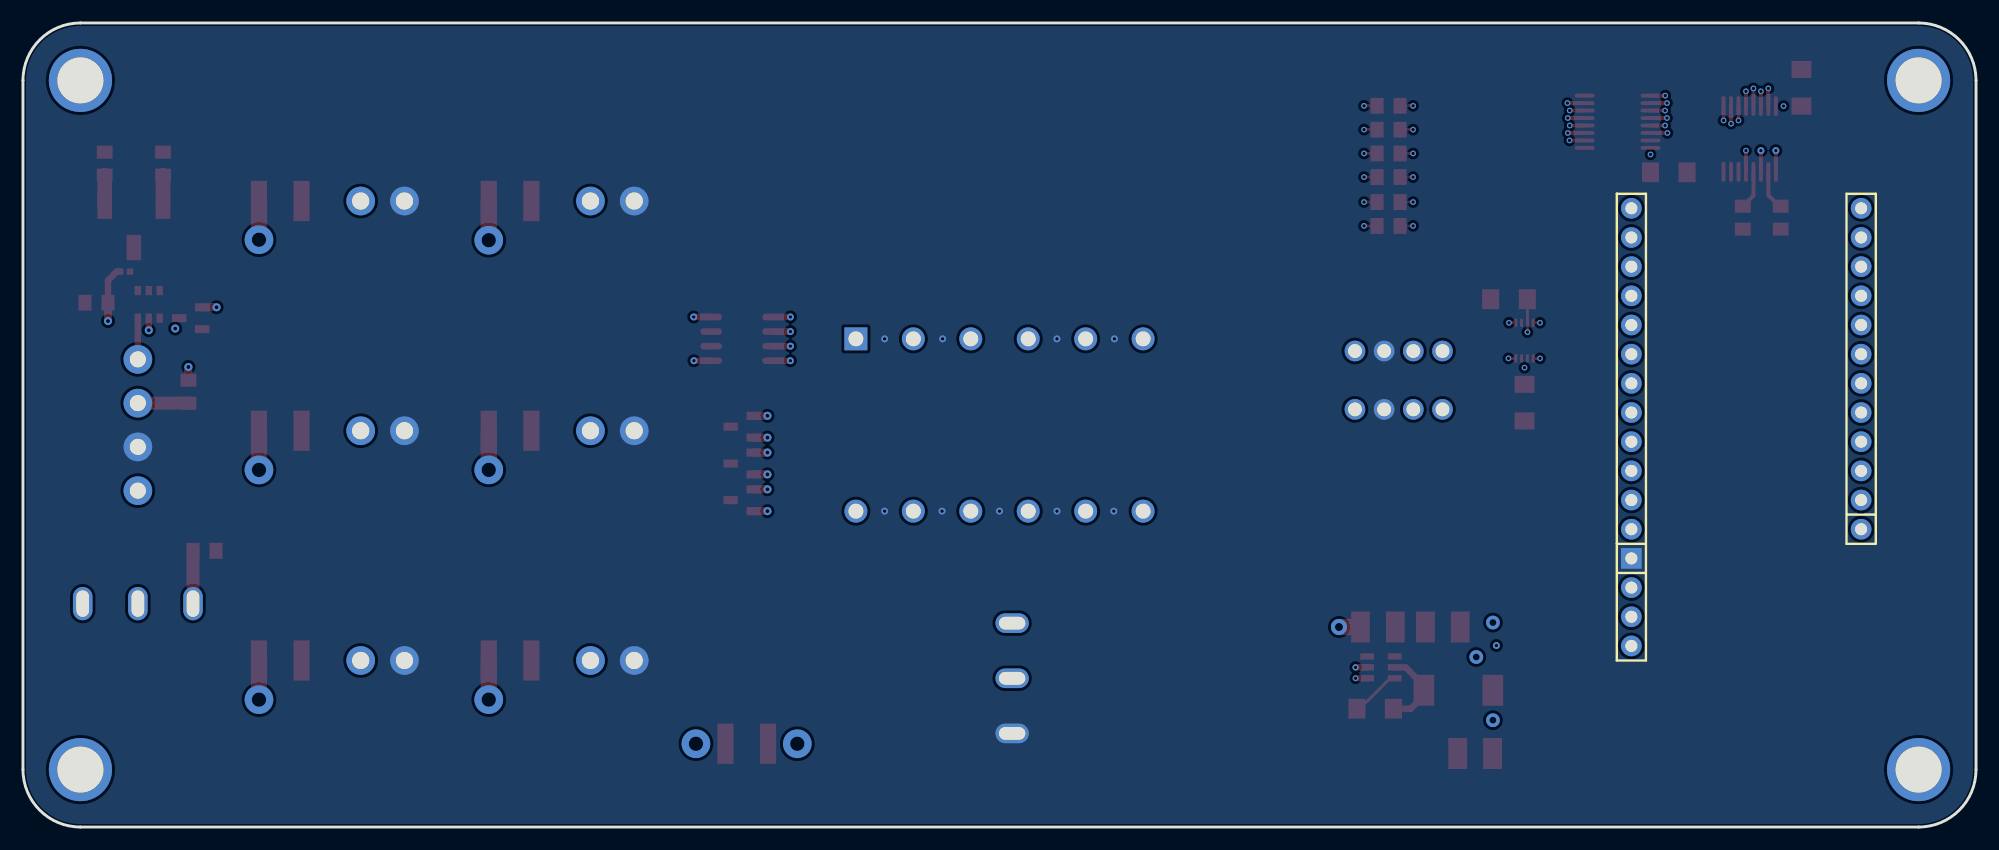
[diagram p3: board, bottom side, seen from below]

Outline 170 x 70 mm; copper layers: Top Layer, Inner1, Inner2, Bottom Layer. Coordinates in mm from the lower left corner of the outline.
Outline path: 0,65 0,5 arc(1.46,1.46) 5,0 165,0 arc(168.54,1.46) 170,5 170,65 arc(168.54,68.54) 165,70 5,70 arc(1.46,68.54) 0,65
Stack: Top Layer 0.035mm Outer layer copper thickness 1oz / Dielectric1 0.2104mm 7628 RC49% 8.6mil / Inner1 0.0152mm Inner layer copper thickness / Dielectric2 1.065mm 1.1mm H/HOZ Copper / Inner2 0.0152mm Inner layer copper thickness / Dielectric3 0.2104mm 7628 RC49% 8.6mil / Bottom Layer 0.035mm Outer layer copper thickness 1oz

## Design rules (mm)
template: Custom Config
spacing copperThickness1oz (default): track to track 0.102, other pairs 0.152 to 0.3
spacing copperThickness2oz: track to track 0.203, other pairs 0.152 to 0.3
track width copperThickness1oz (default): min 0.127, default 0.254, max 2.54
track width copperThickness2oz: min 0.203, default 0.254, max 2.54
differential pair differentialPair (default): width min 0.127, default 0.254, max 2.54; gap min 0.152, default 0.152
via viaSize (default): diameter min 0.5, default 0.61, max 10; hole min 0.3, default 0.305, max 6.3
pour e66318 uses copperRegionDirect
pour e71 uses copperRegionDirect

## Placement (name value [footprint] x y rotation side)
C1  10uF  [C1210]  52.06 17.41 180 top
C2  100nF  [C1206]  52.3 10.3 180 top
C3  22uF  [C1210]  43.6 6.4 0 top
C4  22uF  [C1210]  46.41 17.41 0 top
C5  100nF  [C1206]  15.2 64.36 90 top
C6  100nF  [C1206]  26.74 57 180 top
C8  100nF  [C1206]  40.65 45.95 180 top
C9  100nF  [C1206]  39.3 36.95 270 top
CN1  DB2EVC-3.81-4P-GN  [CONN-TH_4P-P3.81_DB2EVC-3.81-4P]  160 35 90 top
CN2  KF250T-5.0-2*6P  [CONN-TH_KF250T-5.0-2X6P]  85 35 180 top
CN3  DB2EVC-3.81-2P-GN  [CONN-TH_2P-P3.81_DB2EVC-3.81-2P-BK]  118.7 54.5 180 top
CN4  DB2EVC-3.81-2P-GN  [CONN-TH_2P-P3.81_DB2EVC-3.81-2P-BK]  138.7 54.5 180 top
CN5  DB2EVC-3.81-2P-GN  [CONN-TH_2P-P3.81_DB2EVC-3.81-2P-BK]  118.7 34.5 180 top
CN6  DB2EVC-3.81-2P-GN  [CONN-TH_2P-P3.81_DB2EVC-3.81-2P-BK]  138.7 34.5 180 top
CN7  DB2EVC-3.81-2P-GN  [CONN-TH_2P-P3.81_DB2EVC-3.81-2P-BK]  118.7 14.5 180 top
CN8  DB2EVC-3.81-2P-GN  [CONN-TH_2P-P3.81_DB2EVC-3.81-2P-BK]  138.7 14.5 180 top
D1  ESDA6V1U1RL  [SO-8_L4.9-W3.9-P1.27-LS5.9-BL]  107.4 42.5 270 top
F1  MF-MSMF110/16-2  [F1812]  107 7.25 180 top
F2  MF-MSMF110/16-2  [F1812]  127.6 54.5 180 top
F3  MF-MSMF110/16-2  [F1812]  147.6 54.5 180 top
F4  MF-MSMF110/16-2  [F1812]  127.6 34.5 180 top
F5  MF-MSMF110/16-2  [F1812]  147.6 34.5 180 top
F6  MF-MSMF110/16-2  [F1812]  127.6 14.5 180 top
F7  MF-MSMF110/16-2  [F1812]  147.6 14.5 180 top
H1  A2541HWV-12P  [HDR-TH_12P-P2.54-V-F]  10 39.9 180 top
H2  ZX-PM2.54-1-16PY  [HDR-TH_16P-P2.54-V-F-A]  30 34.82 180 top
H3  JL141V-25404GA1  [CONN-TH_4P-P2.54_JILN_JL141V-25404GA1]  50.25 38.9 0 top
H4  X6511WVS-03H-C60D48R2  [HDR-SMD_3P-P2.54_XKB_X6511WVS-03H-C60D48R2]  160.35 52.25 180 top
L1  4.7uH  [IND-SMD_L7.0-W7.0_CDRR7D45T125NP]  45.06 11.91 180 top
NOREF  -  [Pad_e31]  5 65 0 top
NOREF#2  -  [Pad_e35]  165 65 0 top
NOREF#3  -  [Pad_e34]  165 5 0 top
NOREF#4  -  [Pad_e30]  5 5 0 top
Q1  2N7002KQ-13  [SOT-23-3_L2.9-W1.3-P1.90-LS2.4-BR]  155.4 44.3 180 top
R1  100Ω  [R0805]  51.14 58.64 180 top
R2  100Ω  [R0805]  51.14 60.71 180 top
R3  100Ω  [R0805]  51.14 62.79 180 top
R4  100Ω  [R0805]  51.14 56.58 0 top
R5  100Ω  [R0805]  51.14 54.41 0 top
R6  100Ω  [R0805]  51.14 52.33 0 top
R8  0Ω  [R0805]  17 53.05 90 top
R9  0Ω  [R0805]  20.3 53.05 90 top
R10  12kΩ  [R0805]  155.6 37.9 270 top
R11  1.78Ω  [R0805]  162.89 57.75 270 top
R12  3.09Ω  [R0805]  157.81 57.75 270 top
R13  470Ω  [R0402]  161.12 48.35 180 top
R14  10k  [R0805]  163.6 45.65 180 top
R15  1kΩ  [R0805]  154.2 24.05 180 top
SW1  SS12D10G4 071  [SW-TH_SHOU-HAN_SS12D10G4]  83.9 12.95 270 top
SW2  SS12D10G4 071  [SW-TH_SHOU-HAN_SS12D10G4]  160 19.45 180 top
U1  SN74LV4051ATPWRQ1  [TSSOP-16_L5.0-W4.4-P0.65-LS6.4-BL]  19.7 59.9 0 top
U2  SN74HCS365PWR  [TSSOP-16_L5.0-W4.4-P0.65-LS6.4-BL]  31.2 61.4 90 top
U3  AP63205WU-7  [TSOT-23-6_L2.9-W1.6-P0.95-LS2.8-BL]  51.8 13.9 90 top
U4  PESD3V3L2BT-ES  [SOT-23-3_L2.9-W1.3-P0.95-LS2.4-BR]  107.4 28.45 180 top
U5  PESD3V3L2BT-ES  [SOT-23-3_L2.9-W1.3-P0.95-LS2.4-BR]  107.4 31.65 180 top
U6  PESD3V3L2BT-ES  [SOT-23-3_L2.9-W1.3-P0.95-LS2.4-BR]  107.4 34.85 180 top
U7  AL5801W6Q-7  [SOT-26-6_L3.0-W1.6-P0.95-LS2.8-BL]  159.05 45.5 0 top
U8  TXS0102DCUR  [VSON8_L2.0-W2.3-P0.50-LS3.1-BL]  39.3 42.35 180 top

## Footprints (pads in the part's own frame, mm; a bottom-side part is the same pattern mirrored in y, then rotated)
C1206
  rect 1.485x1.728 smd: 1(-1.593,0) 2(1.593,0)
C1210
  rect 1.635x2.7 smd: 1(-1.518,0) 2(1.518,0)
CONN-TH_2P-P3.81_DB2EVC-3.81-2P-BK
  round 2.5 hole 1.5: 1(-1.905,0) 2(1.905,0)
CONN-TH_4P-P2.54_JILN_JL141V-25404GA1
  round 1.8 hole 1.2: 1(-3.81,2.54) 1(-3.81,-2.54) 2(-1.27,2.54) 2(-1.27,-2.54) 3(1.27,2.54) 3(1.27,-2.54) 4(3.81,2.54) 4(3.81,-2.54)
CONN-TH_4P-P3.81_DB2EVC-3.81-4P
  round 2.5 hole 1.4: 1(-5.715,0) 2(-1.905,0) 3(1.905,0) 4(5.715,0)
CONN-TH_KF250T-5.0-2X6P
  rect 2x2 hole 1.3: 1(-12.5,-7.5)
  round 2 hole 1.3: 2(-12.5,7.5) 3(-7.5,-7.5) 4(-7.5,7.5) 5(-2.5,-7.5) 6(-2.5,7.5) 7(2.5,-7.5) 8(2.5,7.5) 9(7.5,-7.5) 10(7.5,7.5) 11(12.5,-7.5) 12(12.5,7.5)
F1812
  rect 1.407x3.499 smd: 1(-1.853,0) 2(1.853,0)
HDR-SMD_3P-P2.54_XKB_X6511WVS-03H-C60D48R2
  rect 1.27x2.2 smd: 1(-2.54,-1.8) 2(0,1.8) 3(2.54,-1.8)
HDR-TH_12P-P2.54-V-F
  round 1.8 hole 1.05: 1(0,13.97) 2(0,11.43) 3(0,8.89) 4(0,6.35) 5(0,3.81) 6(0,1.27) 7(0,-1.27) 8(0,-3.81) 9(0,-6.35) 10(0,-8.89) 11(0,-11.43) 12(0,-13.97)
HDR-TH_16P-P2.54-V-F-A
  round 1.801 hole 1.05: 1(0,19.05)
  round 1.8 hole 1.05: 2(0,16.51) 3(0,13.97) 5(0,8.89) 6(0,6.35) 7(0,3.81) 8(0,1.27) 9(0,-1.27) 10(0,-3.81) 11(0,-6.35) 12(0,-8.89) 13(0,-11.43) 14(0,-13.97) 15(0,-16.51) 16(0,-19.05)
  rect 1.8x1.8 hole 1.05: 4(0,11.43)
IND-SMD_L7.0-W7.0_CDRR7D45T125NP
  rect 1.8x2.7 smd: 1(-3,0) 2(3,0)
Pad_e30
  round 5.5 hole 4: 1(0,0)
Pad_e31
  round 5.5 hole 4: 1(0,0)
Pad_e34
  round 5.5 hole 4: 1(0,0)
Pad_e35
  round 5.5 hole 4: 1(0,0)
R0402
  rect 0.566x0.54 smd: 1(-0.433,0) 2(0.433,0)
R0805
  rect 1.133x1.377 smd: 1(-1,0) 2(1,0)
SO-8_L4.9-W3.9-P1.27-LS5.9-BL
  oval 0.574x1.888 smd: 1(-1.905,-2.699) 2(-0.635,-2.699) 3(0.635,-2.699) 4(1.905,-2.699) 5(1.905,2.699) 6(0.635,2.699) 7(-0.635,2.699) 8(-1.905,2.699)
SOT-23-3_L2.9-W1.3-P0.95-LS2.4-BR
  rect 1.25x0.7 smd: 1(1,-0.95) 2(1,0.95) 3(-1,0)
SOT-23-3_L2.9-W1.3-P1.90-LS2.4-BR
  rect 1.25x0.7 smd: 1(1,-0.95) 2(1,0.95) 3(-1,0)
SOT-26-6_L3.0-W1.6-P0.95-LS2.8-BL
  rect 0.55x0.8 smd: 1(-0.95,-1.2) 2(0,-1.2) 3(0.95,-1.2) 4(0.95,1.2) 5(0,1.2) 6(-0.95,1.2)
SW-TH_SHOU-HAN_SS12D10G4
  oval 1.7x2.9 hole 1.1x2.3: 1(-4.8,0) 2(0,0) 3(4.8,0)
TSOT-23-6_L2.9-W1.6-P0.95-LS2.8-BL
  rect 0.55x1.2 smd: 1(-0.95,-1.2) 2(0,-1.2) 3(0.95,-1.2) 4(0.95,1.2) 5(0,1.2) 6(-0.95,1.2)
TSSOP-16_L5.0-W4.4-P0.65-LS6.4-BL
  oval 0.343x1.732 smd: 1(-2.275,-2.866) 2(-1.625,-2.866) 3(-0.975,-2.866) 4(-0.325,-2.866) 5(0.325,-2.866) 6(0.975,-2.866) 7(1.625,-2.866) 8(2.275,-2.866) 9(2.275,2.866) 10(1.625,2.866) 11(0.975,2.866) 12(0.325,2.866) 13(-0.325,2.866) 14(-0.975,2.866) 15(-1.625,2.866) 16(-2.275,2.866)
VSON8_L2.0-W2.3-P0.50-LS3.1-BL
  rect 0.25x0.7 smd: 1(-0.762,-1.55) 2(-0.254,-1.55) 3(0.254,-1.55) 4(0.762,-1.55) 5(0.762,1.55) 6(0.254,1.55) 7(-0.254,1.55) 8(-0.762,1.55)

## Nets
As in the schematic, except:
$1N8098: R13.1 R14.2 U7.2

Pads without a net: H1 1 2 4 9 10; H2 1 3 11 13 14 15 16; NOREF 1; NOREF#2 1; NOREF#3 1; NOREF#4 1; U7 5

## Via types
v1: diameter 0.61, hole 0.305, Top Layer to Bottom Layer, 18 vias
v2: diameter 0.5, hole 0.3, Top Layer to Bottom Layer, 41 vias
v3: diameter 1.2, hole 0.6, Top Layer to Bottom Layer, 3 vias
v4: diameter 0.7, hole 0.35, Top Layer to Bottom Layer, 11 vias
v5: diameter 2.5, hole 1.25, Top Layer to Bottom Layer, 8 vias
v6: diameter 0.55, hole 0.3, Top Layer to Bottom Layer, 1 via
v7: diameter 1.407, hole 0.704, Top Layer to Bottom Layer, 1 via

## Routing (per net, layer and track width the routed paths; a pad name or vN(x,y) marks a point on that pad's centre or on a via; arc(x,y) is an arc through that point)
+3.3V: length 2.9
  Top Layer w0.25: C8.2 39.05,45.94 U8.3 v2(39.05,43.08)
+5V: length 5.4
  Top Layer w0.55: v2(54,12.95) U3.1
  Top Layer w1.13: CN1.3 159.99,36.9 R10.2
  vias: v1(41.75,15.8) v2(16.76,62.77) v2(28.33,58.55) v2(39.3,39.99) v3(42.05,17.8) v3(42.05,9.3) v3(43.5,14.8)
GND:
  vias: v1(75,42.5) v1(75.05,27.5) v1(80,42.5) v1(80,27.5) v1(85,27.5) v1(89.95,42.5) v1(90,27.5) v1(95,42.5) v1(95,27.5)
VCC: length 71.7
  Inner1 w2.5: CN1.1 164.8,24.48 SW2.1 164.8,17.05 155,7.25 v5(111.42,7.25)
A: length 25.3
  Top Layer w0.343: U1.11 v2(20.67,61.51)
  Inner1 w0.343: v2(20.67,61.51) 17.51,61.51 12.6,56.6 12.6,46.31 H1.8
A1: length 21
  Top Layer w0.343: 34.1,59.78 v2(35.38,59.78) ; U1.13 v2(19.38,64.3)
  Inner2 w0.343: v2(19.38,64.3) 19.72,64.65 28,64.65 32.88,59.78 v2(35.38,59.78)
A2: length 21.7
  Top Layer w0.343: U2.4 v2(35.37,61.08) ; 18.72,62.77 v2(18.72,64.05)
  Inner2 w0.343: v2(18.72,64.05) 18.72,64.62 19.25,65.15 28.4,65.15 32.47,61.08 v2(35.37,61.08)
A3: length 22.4
  Top Layer w0.343: U1.15 v2(18.08,64.3) ; U2.6 v2(35.37,62.38)
  Inner2 w0.343: v2(18.08,64.3) 18.08,64.88 18.85,65.65 28.9,65.65 32.17,62.38 v2(35.37,62.38)
A4: length 10
  Top Layer w0.343: v2(20.03,64.05) U1.12 ; U2.10 v2(26.9,63.03)
  Inner2 w0.343: v2(26.9,63.03) 26.37,63.03 25.35,64.05 v2(20.03,64.05)
A5: length 13.9
  Top Layer w0.343: U1.1 v1(17.42,58.88) ; 28.33,61.72 v2(26.9,61.72)
  Inner2 w0.343: v2(26.9,61.72) 24.53,61.72 22.36,59.56 18.11,59.56 17.42,58.88
A6: length 10.8
  Top Layer w0.343: 28.3,60.42 v2(26.87,60.42) ; v2(20.03,58.88) U1.5
  Inner2 w0.343: v2(26.87,60.42) 24.47,60.42 22.93,58.88 v2(20.03,58.88)
B: length 28.2
  Top Layer w0.343: U1.10 v2(21.33,61.23)
  Inner1 w0.343: v2(21.33,61.23) 20.94,60.85 17.65,60.85 13.8,57 13.8,44.97 H1.7
C: length 31.1
  Top Layer w0.343: U1.9 v2(21.97,61.51)
  Inner1 w0.343: H1.6 15.15,43.78 15.15,57.6 17.9,60.35 21.35,60.35 21.97,60.97 v2(21.97,61.51)
COM: length 26.3
  Top Layer w0.343: 18.72,57.03 v1(18.72,58.88)
  Inner1 w0.343: H2.12 29.99,43.7 22.1,43.7 18.72,47.08 v1(18.72,58.88)
EN1: length 81.8
  Top Layer w0.7: U4.2 v4(105.2,27.5)
  Inner2 w0.343: H2.5 35.73,20.2 90.2,20.2 CN2.2 v4(105.2,27.5)
EN2: length 82.7
  Top Layer w0.7: U4.1 v4(105.2,29.4)
  Inner2 w0.343: H2.6 36.87,21.6 87,21.6 92.5,27.1 CN2.4 94.4,29.4 v4(105.2,29.4)
EN3: length 82.8
  Top Layer w0.7: U5.2 v4(105.2,30.7)
  Inner2 w0.343: H2.7 37.91,23.1 83.1,23.1 CN2.6 90.7,30.7 v4(105.2,30.7)
EN4: length 83.4
  Top Layer w0.7: U5.1 v4(105.2,32.6)
  Inner2 w0.343: v4(105.2,32.6) 87.6,32.6 CN2.8 79.6,24.6 38.95,24.6 H2.8
EN5: length 83.8
  Top Layer w0.7: U6.2 v4(105.2,33.9)
  Inner2 w0.343: v4(105.2,33.9) 83.9,33.9 CN2.10 76.05,26.05 40.04,26.05 H2.9
EN6: length 84.4
  Top Layer w0.7: U6.1 105.2,35.8
  Inner2 w0.343: H2.10 41.13,27.5 CN2.12 80.15,35.15 104.55,35.15 v4(105.2,35.8)
PLED: length 139.5
  Top Layer w1.407: v5(149.46,31.09) F5.1 ; v5(129.46,51.09) F2.1 ; v5(149.46,51.13) F3.1 ; v5(149.46,11.09) F7.1 ; v5(129.46,31.09) F4.1 ; v5(129.46,11.09) F6.1
  Inner1 w2.5: v5(149.46,31.09) 149.45,31.09 v5(129.46,31.09) ; v5(149.46,31.09) 152.16,31.09 160,23.25 SW2.2 160,18 ; v5(149.46,31.09) v5(149.46,51.13) ; v5(149.46,31.09) v5(149.46,11.09) ; v5(129.46,31.09) v5(129.46,11.09) ; v5(129.46,31.09) v5(129.46,51.09)
PWM0: length 174.6
  Top Layer w0.7: Q1.1 v4(153.15,45.25)
  Inner2 w0.7: H1.5 16.1,29.99 16.1,20.55 25.75,10.9 104.65,10.9 139,45.25 v4(153.15,45.25)
SCLI: length 45.3
  Top Layer w0.25: v2(37.95,43.9) U8.4
  Inner2 w0.5: H1.11 8.35,52.98 8.35,54.25 10.9,56.8 33.7,56.8 37.95,52.55 v2(37.95,43.9)
SCLO: length 15
  Top Layer w0.25: v2(40.65,43.9) U8.1
  Inner1 w0.5: v2(40.65,43.9) 46.52,43.9 H3.2
  Inner1 w1.2: H3.2 H3.2
SDAI: length 41.1
  Top Layer w0.25: v2(37.95,40.8) U8.5
  Inner2 w0.5: v2(37.95,40.8) 36.6,42.15 36.6,52.1 33.2,55.5 11.63,55.5 H1.12
SDAO: length 11.7
  Top Layer w0.25: v2(40.7,40.8) U8.8
  Inner1 w0.5: H3.1 41.34,41.44 v2(40.7,40.8)
  Inner1 w1.2: H3.1 H3.1
SINK: length 3.6
  Top Layer w0.55: U7.3 CN1.4
Y1: length 68.5
  Top Layer w0.25: R1.1 v2(53.27,58.64)
  Top Layer w0.574: D1.1 v1(103.2,44.41)
  Inner1 w0.343: v2(53.27,58.64) 77.96,58.64 84.55,52.05 84.55,41.3 85.95,39.9 94.9,39.9 CN2.1 99.41,44.41 v1(103.2,44.41)
Y2: length 76.3
  Top Layer w0.25: 53.33,60.71 R2.1
  Top Layer w0.574: D1.2 v1(103.2,43.14)
  Inner1 w0.343: v1(103.2,43.14) 104.31,43.14 104.65,43.48 104.65,45.41 104.31,45.75 95.75,45.75 CN2.3 91.05,41.05 86.9,41.05 85.8,42.15 85.8,56.6 81.69,60.71 v2(53.27,60.71)
Y3: length 83.4
  Top Layer w0.25: 53.33,62.79 R3.1
  Top Layer w0.574: D1.3 v1(103.2,41.86)
  Inner1 w0.343: v2(53.27,62.79) 82.61,62.79 ; 107.15,43.8 107.15,43 106.01,41.86 v1(103.2,41.86) ; 107.15,43.86 107.15,45.8 106.1,46.85 91.85,46.85 CN2.5 87.5,57.9 82.61,62.79
Y4: length 65.6
  Top Layer w0.25: R4.2 v2(53.27,56.58)
  Top Layer w0.574: D1.4 v1(103.2,40.59)
  Inner1 w0.343: v2(53.27,56.58) 74.42,56.58 82.5,48.5 CN2.7 82.5,40.05 83.75,38.8 101.41,38.8 v1(103.2,40.59)
Y5: length 72.5
  Top Layer w0.25: R5.2 v2(53.27,54.41)
  Top Layer w0.574: D1.5 v1(111.6,40.59)
  Inner1 w0.343: v2(53.27,54.41) 71.44,54.41 ; 111.59,40.59 108.65,37.65 82.35,37.65 CN2.9 77.5,48.35 71.44,54.41
Y6: length 77.3
  Top Layer w0.25: v2(53.27,52.33) R6.2
  Top Layer w0.574: v1(111.62,44.41) 110.12,44.41
  Inner1 w0.343: v2(53.27,52.33) 67.77,52.33 72.5,47.6 CN2.11 78.2,36.8 109.2,36.8 112.5,40.1 112.5,43.52 v1(111.62,44.41)
$1N1490: length 53.2
  Top Layer w1.407: v7(55.45,17.41) C1.1
  Inner1 w2.5: v7(55.45,17.41) 92.44,17.41 v5(102.6,7.25)
$1N1493: length 4.4
  Top Layer w0.25: U3.6 51,12.95 53.65,10.3 C2.1
$1N1494: length 7.2
  Top Layer w0.55: U3.5 49.65,13.9 48.06,12.31 L1.1 48.06,11.44 49.2,10.3 C2.2
$1N1619: length 31.3
  Top Layer w0.55: v6(54,13.9) U3.2
  Inner1 w0.55: v6(54,13.9) 60.1,13.9 61.05,12.95
  Inner1 w1.7: 61.05,12.95 SW1.2
$1N2001: length 16.8
  Top Layer w0.25: R1.2 v2(49,58.64)
  Top Layer w0.343: v2(35.53,60.42) 34.07,60.42
  Inner1 w0.343: v2(35.53,60.42) 46.17,60.42 47.96,58.64 v2(49,58.64)
$1N2005: length 16.5
  Top Layer w0.25: v2(49,60.71) R2.2
  Top Layer w0.343: 34.1,61.72 v2(35.53,61.72)
  Inner1 w0.343: v2(49,60.71) 48.64,60.71 47.62,61.72 v2(35.53,61.72)
$1N2010: length 16.1
  Top Layer w0.25: v2(49,62.79) 50.13,62.79
  Top Layer w0.343: 34.13,63.03 v2(35.57,63.03)
  Inner1 w0.343: v2(49,62.79) 35.81,62.79 v2(35.57,63.03)
$1N2012: length 27.3
  Top Layer w0.25: v2(49,56.58) R4.1
  Top Layer w0.343: U2.9 v2(27.05,63.67)
  Inner1 w0.343: v2(49,56.58) 35.17,56.58 28.07,63.67 v2(27.05,63.67)
$1N2014: length 27.6
  Top Layer w0.25: 50.13,54.41 v2(49,54.41)
  Top Layer w0.343: v2(27.07,62.38) U2.11
  Inner1 w0.343: v2(49,54.41) 36.49,54.41 28.53,62.38 v2(27.07,62.38)
$1N2016: length 27.9
  Top Layer w0.25: R6.1 v2(49,52.33)
  Top Layer w0.343: 28.3,61.08 v2(27.07,61.08)
  Inner1 w0.343: v2(27.07,61.08) 29.03,61.08 37.77,52.33 v2(49,52.33)
$1N3607: length 3.5
  Top Layer w0.343: R8.2 17.12,54.05 18.08,55 U1.2
$1N3609: length 3.4
  Top Layer w0.343: U1.4 19.38,54.97 R9.2
$1N7662: length 5
  Top Layer w0.7: v4(155.6,40.05) R10.1
  Inner1 w0.7: v4(156.75,43.4) 155.6,42.25 v4(155.6,40.05)
$1N7863: length 2.7
  Top Layer w1.27: H4.1 R11.2
$1N7940: length 2.7
  Top Layer w1.27: H4.3 R12.2
$1N8098: length 9.8
  Top Layer w0.55: R14.2 162.6,47.6 161.85,48.35 R13.1 ; v4(159.05,43.25) U7.2
  Top Layer w0.7: v4(162.6,44.05) R14.2
  Inner1 w0.7: v4(162.6,44.05) 161.8,43.25 v4(159.05,43.25)
$2N9936: length 4.6
  Top Layer w1.133: SW2.3 R15.1

## Copper pours and planes (outline as drawn; the poured copper is in the pictures)
+3.3V on Inner2: -1,71 171,71 171,-1 -1,-1
+5V on Top Layer: 14.35,63.5 17.59,63.5 17.59,62.02 14.35,62.02
+5V on Top Layer: 27.6,59.24 29.08,59.24 29.08,56.15 27.6,56.15
+5V on Top Layer: 38.92,41.14 39.68,41.14 39.68,40 40.15,39.53 40.15,37.8 38.45,37.8 38.45,39.55 38.92,40.02
+5V on Top Layer: 43.3,4.7 40.9,4.7 40.9,18.9 45.8,18.9 45.8,15.4 43.3,12.9
+5V on Inner1: -1,71 171,71 171,-1 -1,-1
GND on Top Layer: -1,71 171,71 171,-1 -1,-1
GND on Bottom Layer: -1.05,71 170.95,71 170.95,-1 -1.05,-1
VCC on Top Layer: 108.15,9 111.45,9 112.65,7.8 112.65,6.7 111.45,5.5 108.15,5.5
$1N1490 on Top Layer: 105.85,9 105.85,5.5 102.6,5.5 101.35,6.75 101.35,7.75 102.6,9
$1N1490 on Top Layer: 52.4,14.55 53.6,14.55 54.4,15.35 54.4,18.8 52.76,18.8 52.76,15.51 52.4,15.15
$1N7662 on Top Layer: 155.8,43.85 156.6,43.05 156.9,43.05 157.75,43.9 158.35,43.9 158.35,44.7 155.8,44.7
$1N13533 on Top Layer: 159.7,51.55 159.7,46.3 161,46.3 161,51.55
$2N3226 on Top Layer: 126.45,56.25 120.59,56.25 119.35,55.02 119.35,54 120.6,52.75 126.45,52.75
$2N3269 on Top Layer: 146.45,56.25 140.59,56.25 139.35,55.02 139.35,54 140.6,52.75 146.45,52.75
$2N3312 on Top Layer: 126.45,36.25 120.59,36.25 119.35,35.02 119.35,34 120.6,32.75 126.45,32.75
$2N3355 on Top Layer: 146.45,36.25 140.59,36.25 139.35,35.02 139.35,34 140.6,32.75 146.45,32.75
$2N3398 on Top Layer: 126.45,16.25 120.59,16.25 119.35,15.02 119.35,14 120.6,12.75 126.45,12.75
$2N3441 on Top Layer: 146.45,16.25 140.59,16.25 139.35,15.02 139.35,14 140.6,12.75 146.45,12.75

Small or netless copper shapes (teardrops, artwork), in the pictures only: 121 on Top Layer, 50 on Inner1, 39 on Inner2

## Text on the board
Top Silkscreen Layer: OFF | 350mA | 200mA | GND | VCC | SINK | 5V | ON | SCA | SDL | I2C 5V | LEDS Power | Enable | Signal | Rev 1 | JES - 10/24 | LED1 | LED3 | LED5 | LED2 | LED4 | LED6 | 6 | 5 | 4 | 3 | 2 | 1
